# Altium schematic sheet EP4CE6E22C8N.SchDoc
size A3; SheetNumber: 1; SheetTotal: 5
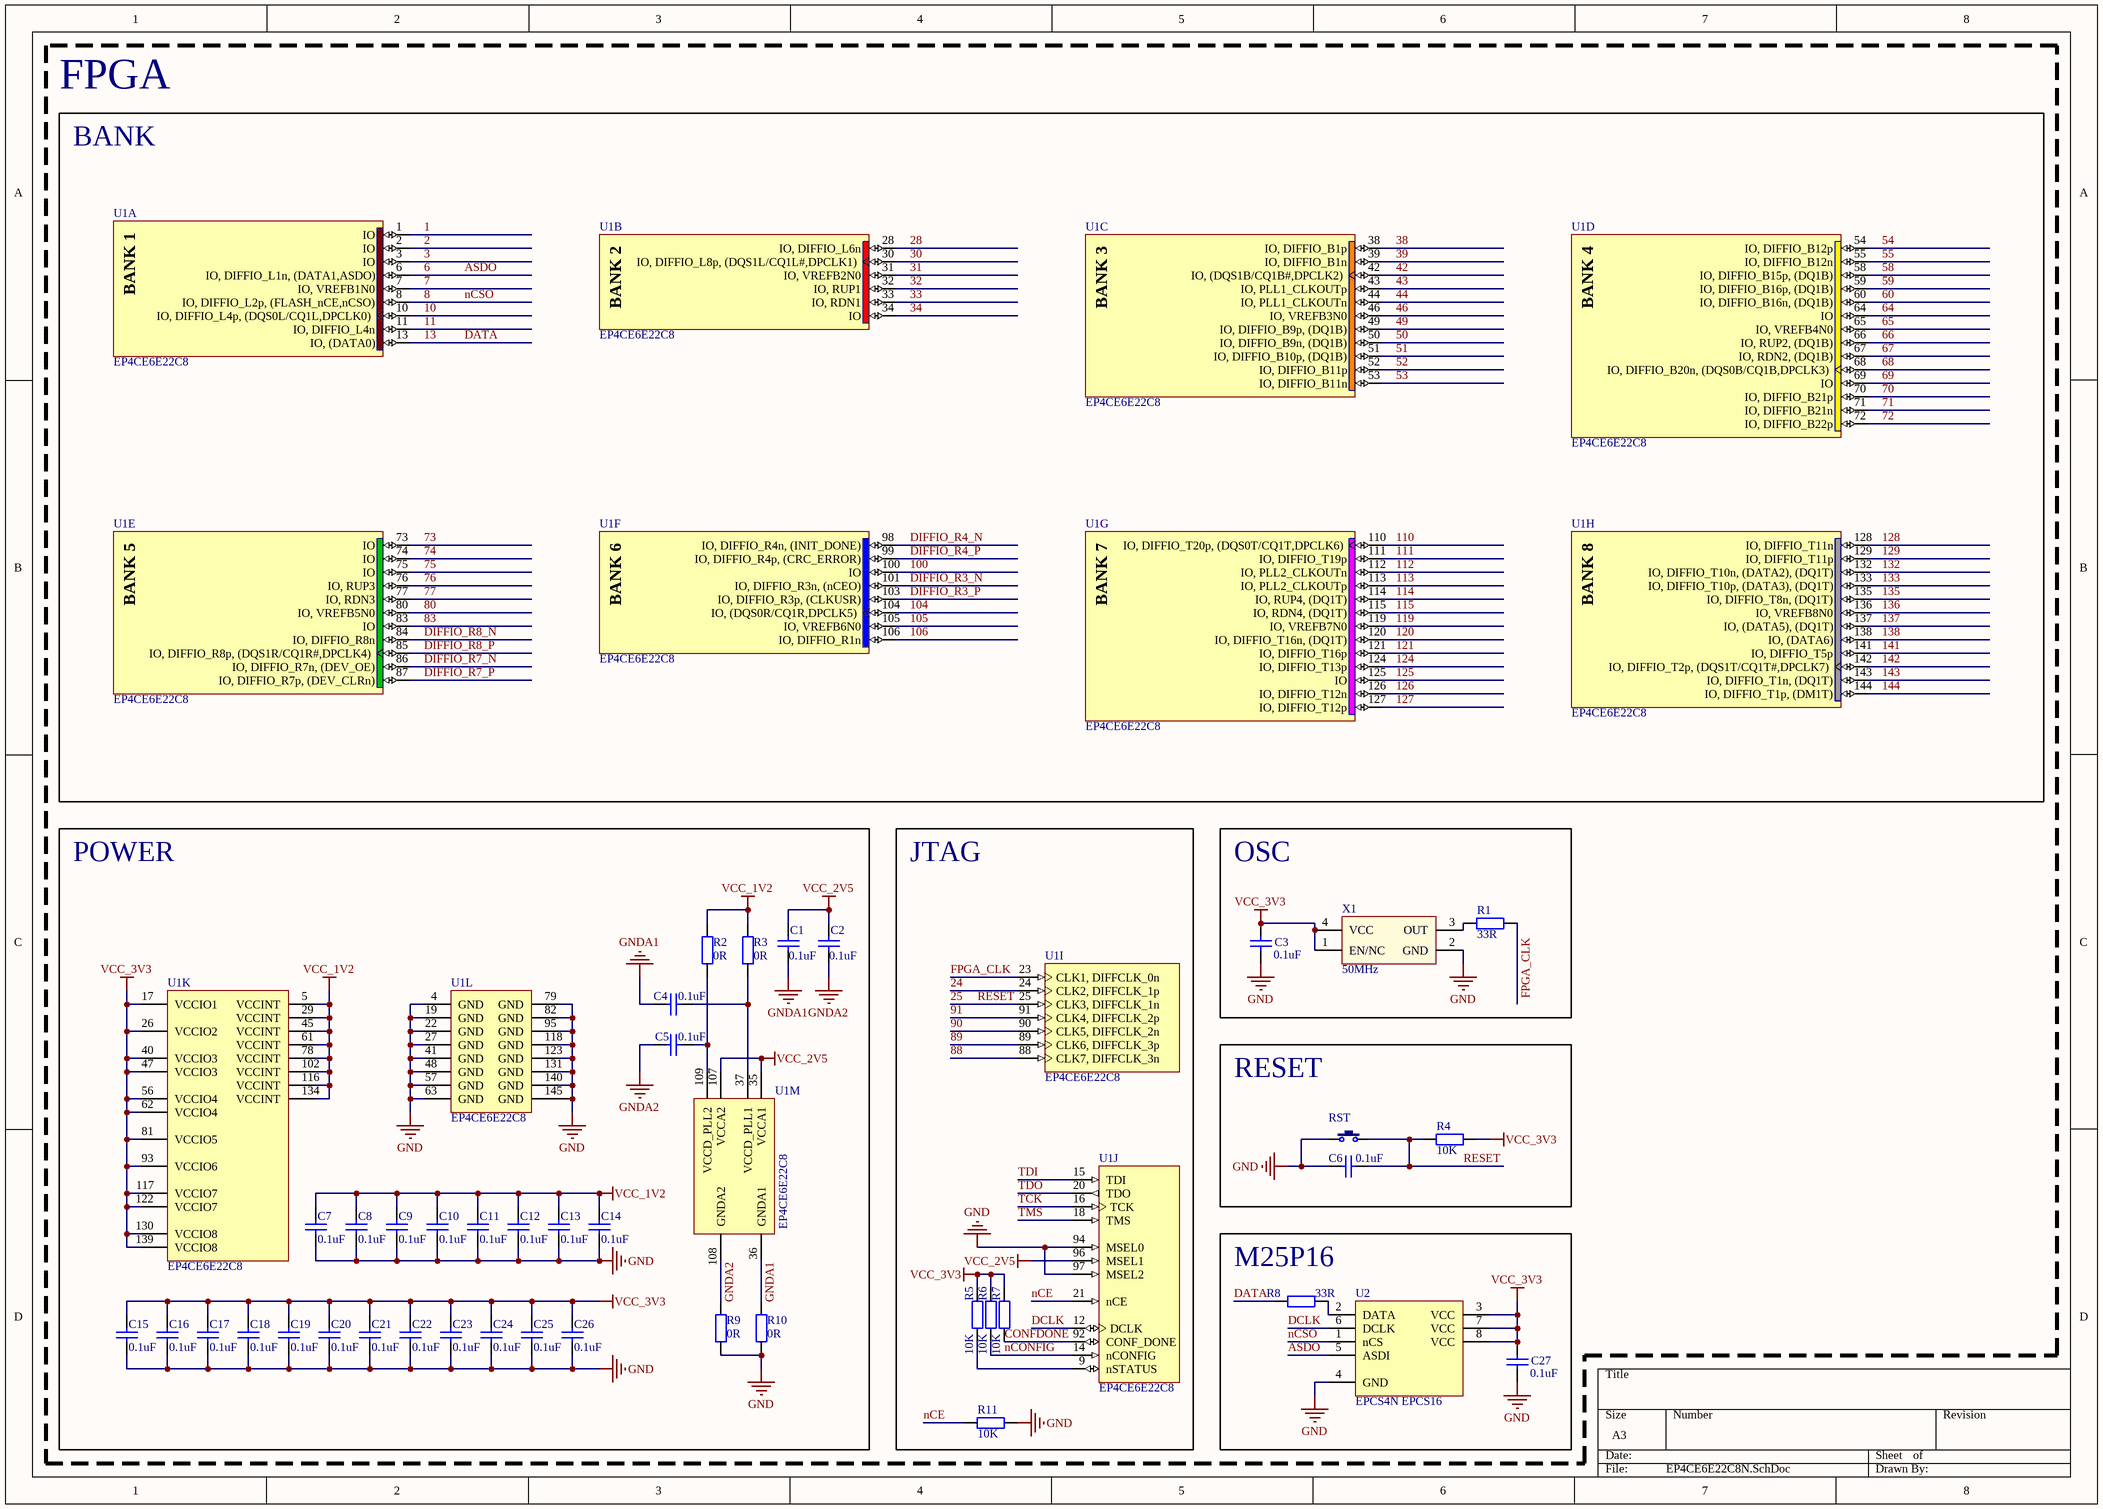
[diagram p0: EP4CE6E22C8N.SchDoc]

## Parts
C1  0.1uF  [0402_C]
C2  0.1uF  [0402_C]
C3  0.1uF  [0402_C]
C4  0.1uF  [0402_C]
C5  0.1uF  [0402_C]
C6  0.1uF  [0402_C]
C7  0.1uF  [0402_C]
C8  0.1uF  [0402_C]
C9  0.1uF  [0402_C]
C10  0.1uF  [0402_C]
C11  0.1uF  [0402_C]
C12  0.1uF  [0402_C]
C13  0.1uF  [0402_C]
C14  0.1uF  [0402_C]
C15  0.1uF  [0402_C]
C16  0.1uF  [0402_C]
C17  0.1uF  [0402_C]
C18  0.1uF  [0402_C]
C19  0.1uF  [0402_C]
C20  0.1uF  [0402_C]
C21  0.1uF  [0402_C]
C22  0.1uF  [0402_C]
C23  0.1uF  [0402_C]
C24  0.1uF  [0402_C]
C25  0.1uF  [0402_C]
C26  0.1uF  [0402_C]
C27  0.1uF  [0402_C]
R1  33R  [0402_R]
R2  0R  [0603_R _MINI]
R3  0R  [0603_R _MINI]
R4  10K  [0402_R]
R5  10K  [0402_R]
R6  10K  [0402_R]
R7  10K  [0402_R]
R8  33R  [0402_R]
R9  0R  [0603_R _MINI]
R10  0R  [0603_R _MINI]
R11  10K  [0402_R]
RST  3x6x5  [SW]  (value not drawn)
U1  EP4CE6E22C8  [EQFP144 20X20_N]  (parts A,B,C,D,E,F,G,H,I,J,K,L,M of 13)
U2  EPCS4N EPCS16  [SOP8_M]
X1  50MHz  [OSC 7050-4P]

## Blocks framed on the sheet
FPGA: U1
POWER: C1 C2 C4 C5 C7-C26 R2 R3 R9 R10 U1
JTAG: R5-R7 R11 U1
OSC: C3 R1 X1
RESET: C6 R4 RST
M25P16: C27 R8 U2

## Nets
GND: C3.1 C6.1 C7.1 C8.1 C9.1 C10.1 C11.1 C12.1 C13.1 C14.1 C15.1 C16.1 C17.1 C18.1 C19.1 C20.1 C21.1 C22.1 C23.1 C24.1 C25.1 C26.1 C27.1 R9.2 R10.2 R11.2 RST.1 U1.4(GND) U1.19(GND) U1.22(GND) U1.27(GND) U1.41(GND) U1.48(GND) U1.57(GND) U1.63(GND) U1.79(GND) U1.82(GND) U1.94(MSEL0) U1.95(GND) U1.97(MSEL2) U1.118(GND) U1.123(GND) U1.131(GND) U1.140(GND) U1.145(GND) U2.4(GND) X1.2(GND)
GNDA1: C1.1 C4.1 R10.1 U1.36(GNDA1)
GNDA2: C2.1 C5.1 R9.1 U1.108(GNDA2)
VCC_1V2: C7.2 C8.2 C9.2 C10.2 C11.2 C12.2 C13.2 C14.2 R2.1 R3.1 U1.5(VCCINT) U1.29(VCCINT) U1.45(VCCINT) U1.61(VCCINT) U1.78(VCCINT) U1.102(VCCINT) U1.116(VCCINT) U1.134(VCCINT)
VCC_2V5: C1.2 C2.2 U1.35(VCCA1) U1.96(MSEL1) U1.107(VCCA2)
VCC_3V3: C3.2 C15.2 C16.2 C17.2 C18.2 C19.2 C20.2 C21.2 C22.2 C23.2 C24.2 C25.2 C26.2 C27.2 R4.2 R5.1 R6.1 R7.1 U1.17(VCCIO1) U1.26(VCCIO2) U1.40(VCCIO3) U1.47(VCCIO3) U1.56(VCCIO4) U1.62(VCCIO4) U1.81(VCCIO5) U1.93(VCCIO6) U1.117(VCCIO7) U1.122(VCCIO7) U1.130(VCCIO8) U1.139(VCCIO8) U2.3(VCC) U2.7(VCC) U2.8(VCC) X1.1(EN/NC) X1.4(VCC)
1: U1.1(IO)
2: U1.2(IO)
3: U1.3(IO)
6: U1.6(IO,_DIFFIO_L1n,_(DATA1,ASDO)) U2.5(ASDI)  [also labelled ASDO]
7: U1.7(IO,_VREFB1N0)
8: U1.8(IO,_DIFFIO_L2p,_(FLASH_nCE,nCSO)) U2.1(nCS)  [also labelled nCSO]
10: U1.10(IO,_DIFFIO_L4p,_(DQS0L/CQ1L,DPCLK0))
11: U1.11(IO,_DIFFIO_L4n)
13: R8.1 U1.13(IO,_(DATA0))  [also labelled DATA]
24: U1.24(CLK2,_DIFFCLK_1p)
25: C6.2 R4.1 RST.2 U1.25(CLK3,_DIFFCLK_1n)  [also labelled RESET]
28: U1.28(IO,_DIFFIO_L6n)
30: U1.30(IO,_DIFFIO_L8p,_(DQS1L/CQ1L#,DPCLK1))
31: U1.31(IO,_VREFB2N0)
32: U1.32(IO,_RUP1)
33: U1.33(IO,_RDN1)
34: U1.34(IO)
38: U1.38(IO,_DIFFIO_B1p)
39: U1.39(IO,_DIFFIO_B1n)
42: U1.42(IO,_(DQS1B/CQ1B#,DPCLK2))
43: U1.43(IO,_PLL1_CLKOUTp)
44: U1.44(IO,_PLL1_CLKOUTn)
46: U1.46(IO,_VREFB3N0)
49: U1.49(IO,_DIFFIO_B9p,_(DQ1B))
50: U1.50(IO,_DIFFIO_B9n,_(DQ1B))
51: U1.51(IO,_DIFFIO_B10p,_(DQ1B))
52: U1.52(IO,_DIFFIO_B11p)
53: U1.53(IO,_DIFFIO_B11n)
54: U1.54(IO,_DIFFIO_B12p)
55: U1.55(IO,_DIFFIO_B12n)
58: U1.58(IO,_DIFFIO_B15p,_(DQ1B))
59: U1.59(IO,_DIFFIO_B16p,_(DQ1B))
60: U1.60(IO,_DIFFIO_B16n,_(DQ1B))
64: U1.64(IO)
65: U1.65(IO,_VREFB4N0)
66: U1.66(IO,_RUP2,_(DQ1B))
67: U1.67(IO,_RDN2,_(DQ1B))
68: U1.68(IO,_DIFFIO_B20n,_(DQS0B/CQ1B,DPCLK3))
69: U1.69(IO)
70: U1.70(IO,_DIFFIO_B21p)
71: U1.71(IO,_DIFFIO_B21n)
72: U1.72(IO,_DIFFIO_B22p)
73: U1.73(IO)
74: U1.74(IO)
75: U1.75(IO)
76: U1.76(IO,_RUP3)
77: U1.77(IO,_RDN3)
80: U1.80(IO,_VREFB5N0)
83: U1.83(IO)
88: U1.88(CLK7,_DIFFCLK_3n)
89: U1.89(CLK6,_DIFFCLK_3p)
90: U1.90(CLK5,_DIFFCLK_2n)
91: U1.91(CLK4,_DIFFCLK_2p)
100: U1.100(IO)
104: U1.104(IO,_(DQS0R/CQ1R,DPCLK5))
105: U1.105(IO,_VREFB6N0)
106: U1.106(IO,_DIFFIO_R1n)
110: U1.110(IO,_DIFFIO_T20p,_(DQS0T/CQ1T,DPCLK6))
111: U1.111(IO,_DIFFIO_T19p)
112: U1.112(IO,_PLL2_CLKOUTn)
113: U1.113(IO,_PLL2_CLKOUTp)
114: U1.114(IO,_RUP4,_(DQ1T))
115: U1.115(IO,_RDN4,_(DQ1T))
119: U1.119(IO,_VREFB7N0)
120: U1.120(IO,_DIFFIO_T16n,_(DQ1T))
121: U1.121(IO,_DIFFIO_T16p)
124: U1.124(IO,_DIFFIO_T13p)
125: U1.125(IO)
126: U1.126(IO,_DIFFIO_T12n)
127: U1.127(IO,_DIFFIO_T12p)
128: U1.128(IO,_DIFFIO_T11n)
129: U1.129(IO,_DIFFIO_T11p)
132: U1.132(IO,_DIFFIO_T10n,_(DATA2),_(DQ1T))
133: U1.133(IO,_DIFFIO_T10p,_(DATA3),_(DQ1T))
135: U1.135(IO,_DIFFIO_T8n,_(DQ1T))
136: U1.136(IO,_VREFB8N0)
137: U1.137(IO,_(DATA5),_(DQ1T))
138: U1.138(IO,_(DATA6))
141: U1.141(IO,_DIFFIO_T5p)
142: U1.142(IO,_DIFFIO_T2p,_(DQS1T/CQ1T#,DPCLK7))
143: U1.143(IO,_DIFFIO_T1n,_(DQ1T))
144: U1.144(IO,_DIFFIO_T1p,_(DM1T))
CONFDONE: R7.2 U1.92(CONF_DONE)
DCLK: U1.12(DCLK) U2.6(DCLK)
DIFFIO_R3_N: U1.101(IO,_DIFFIO_R3n,_(nCEO))
DIFFIO_R3_P: U1.103(IO,_DIFFIO_R3p,_(CLKUSR))
DIFFIO_R4_N: U1.98(IO,_DIFFIO_R4n,_(INIT_DONE))
DIFFIO_R4_P: U1.99(IO,_DIFFIO_R4p,_(CRC_ERROR))
DIFFIO_R7_N: U1.86(IO,_DIFFIO_R7n,_(DEV_OE))
DIFFIO_R7_P: U1.87(IO,_DIFFIO_R7p,_(DEV_CLRn))
DIFFIO_R8_N: U1.84(IO,_DIFFIO_R8n)
DIFFIO_R8_P: U1.85(IO,_DIFFIO_R8p,_(DQS1R/CQ1R#,DPCLK4))
FPGA_CLK: R1.2 U1.23(CLK1,_DIFFCLK_0n)
nCE: R11.1 U1.21(nCE)
nCONFIG: R6.2 U1.14(nCONFIG)
TCK: U1.16(TCK)
TDI: U1.15(TDI)
TDO: U1.20(TDO)
TMS: U1.18(TMS)
NetC4_2: C4.2 R3.2 U1.37(VCCD_PLL1)
NetC5_2: C5.2 R2.2 U1.109(VCCD_PLL2)
NetR1_1: R1.1 X1.3(OUT)
NetR5_2: R5.2 U1.9(nSTATUS)
NetR8_2: R8.2 U2.2(DATA)

## Notes on the sheet
- BANK
- (in symbol EP4CE6E22C8, part A) BANK 1
- (in symbol EP4CE6E22C8, part B) BANK 2
- (in symbol EP4CE6E22C8, part C) BANK 3
- (in symbol EP4CE6E22C8, part D) BANK 4
- (in symbol EP4CE6E22C8, part E) BANK 5
- (in symbol EP4CE6E22C8, part F) BANK 6
- (in symbol EP4CE6E22C8, part G) BANK 7
- (in symbol EP4CE6E22C8, part H) BANK 8

## Library data of the parts
C1-C27 = 0402_C: 贴片电容; ComponentLink1Description: 供应商链接; ComponentLink1URL: http://www.szlcsc.com/product/details_1928.html; Package: 0402; Supplier: LC; SuppliersPartNumber: C1576
R1 R4-R8 R11 = 0402_R: 贴片电阻; ComponentLink1Description: 供应商链接; ComponentLink1URL: http://www.szlcsc.com/product/details_26667.html; Package: 0402; Supplier: LC; SuppliersPartNumber: C25924
R2 R3 R9 R10 = 0603_R_MINI: 贴片电阻; ComponentLink1Description: 供应商链接; ComponentLink1URL: http://www.szlcsc.com/product/details_23987.html; Package: 0603; Supplier: LC; SuppliersPartNumber: C23260
RST = TSW 3x6: 3x6轻触开关; 版权归属: 源创客; BOM名称: 3x6轻触开关; 学习资源: www.ooocke.com
U1 = EP4CE6E22C8: Cyclone IV Family FPGA, 2V Core, 91 I/O Pins, 2 PLLs, 144-Pin QFP, Speed Grade 8, Commercial Grade; Published: 3-May-2010; DatasheetVersion: ver1.2, Mar-2010; PackageVersion: ver16.0, Dec-2009; PackageReference: EQFP144; Publisher: Altium Limited; PackageDescription: 144-Pin Plastic Enhanced Quad Flat Pack (EQFP144) - Wire Bond; Code_JEDEC: MS-026-BFB; ComponentLink1Description: Manufacturer Link; ComponentLink1URL: http://www.altera.com/; ComponentLink2Description: Handbook; ComponentLink2URL: http://www.altera.com/literature/hb/cyclone-iv/cyclone4-handbook.pdf; ComponentLink3Description: Pinout Specification; ComponentLink3URL: http://www.altera.com/literature/lit-dp.jsp?category=cyc%204&showspreadsheet=y; ComponentLink4Description: Packaging Specification; ComponentLink4URL: http://www.altera.com/literature/ds/dspkg.pdf
U2 = EPCS1
X1 = XTAL-ACT-4P: 4脚有源晶振; 版权归属: 源创客; BOM名称: 4脚有源晶振; 学习资源: www.ooocke.com